# Altium project ESP32-PicoDK-min.PrjPCB
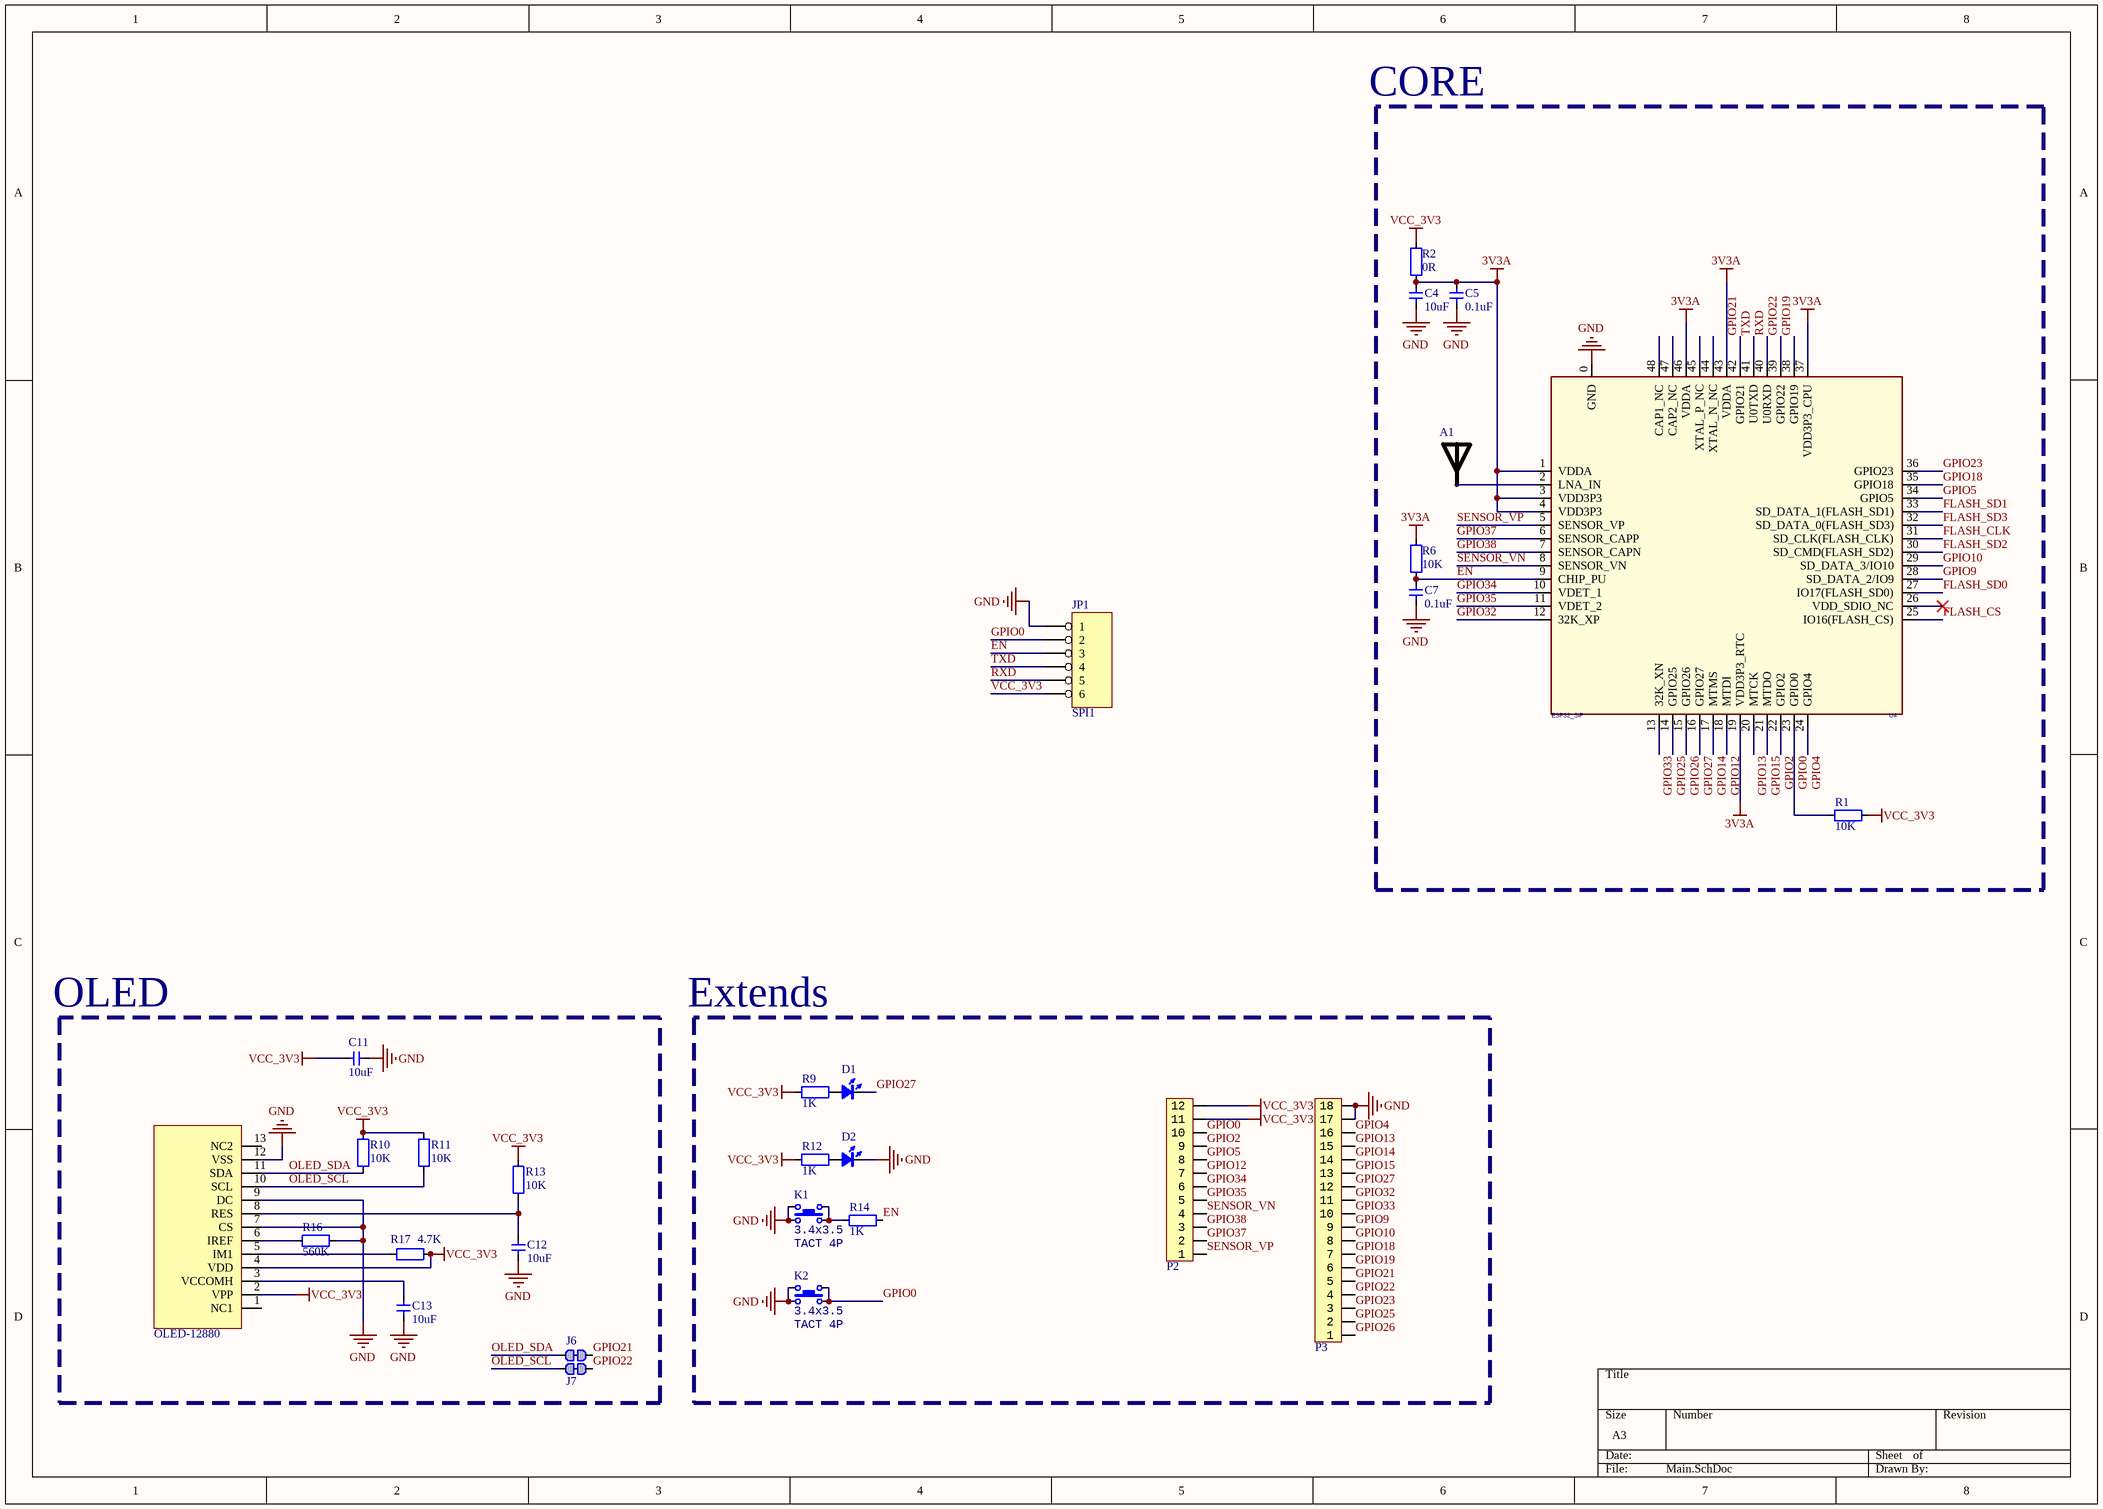
[diagram p0: Main.SchDoc]
1 sheet, 29 parts. Net scope: global (net labels, ports and power ports of the same name join across sheets).
Board file: ESP32-PicoDK-min.PcbDoc

## Sheet Main.SchDoc
size A3

### Parts
1  OLED-12880  [OLED-12880]
A1  RAINSUN  [ANT-Rainsun-AN5120]  (value not drawn)
C4  10uF  [CAP_0402]
C5  0.1uF  [CAP_0402]
C7  0.1uF  [CAP_0402]
C11  10uF  [CAP_0402]
C12  10uF  [CAP_0402]
C13  10uF  [CAP_0402]
D1  color?  [LED_0402_RED]  (value not drawn)
D2  color?  [LED_0402_RED]  (value not drawn)
J6  跳线  [0402-0R]  (value not drawn)
J7  跳线  [0402-0R]  (value not drawn)
JP1  SPI1  [CONN-SMD_6P-P1.25_DEALON_1.25-6PWB]
K1  value 3.4x3.5  [ButtonTACT_3.5*3.55_90]  (hidden comment: TACT 4P)
K2  value 3.4x3.5  [ButtonTACT_3.5*3.55_90]  (hidden comment: TACT 4P)
P2  HDR1x12_2.54  [HDR1X12_2.54_180]  (value not drawn)
P3  HDR1x18_2.54  [HDR1X18_2.54_180]  (value not drawn)
R1  10K  [RES_0402]
R2  0R  [RES_0402]
R6  10K  [RES_0402]
R9  1K  [RES_0402]
R10  10K  [RES_0402]
R11  10K  [RES_0402]
R12  1K  [RES_0402]
R13  10K  [RES_0402]
R14  1K  [RES_0402]
R16  560K  [RES_0402]
R17  4.7K  [RES_0402]
U4  ESP32_SIP  [QFN-48_7X7]

### Nets
3V3A: C4.2 C5.2 R2.2 R6.1 U4.1(VDDA) U4.3(VDD3P3) U4.4(VDD3P3) U4.19(VDD3P3_RTC) U4.37(VDD3P3_CPU) U4.43(VDDA) U4.46(VDDA)
GND: 1.7(CS) 1.9(DC) 1.12(VSS) C4.1 C5.1 C7.2 C11.1 C12.1 C13.1 D2.2(K) JP1.1 K1.1 K1.3 K2.1 K2.3 P3.17 P3.18 R16.2 U4.0(GND)
VCC_3V3: 1.2(VPP) 1.4(VDD) C11.2 JP1.6 P2.11 P2.12 R1.2 R2.1 R9.1 R10.2 R11.2 R12.1 R13.2 R17.2
EN: C7.1 JP1.3 R6.2 R14.2 U4.9(CHIP_PU)
FLASH_CLK: U4.31(SD_CLK(FLASH_CLK))
FLASH_CS: U4.25(IO16(FLASH_CS))
FLASH_SD0: U4.27(IO17(FLASH_SD0))
FLASH_SD1: U4.33(SD_DATA_1(FLASH_SD1))
FLASH_SD2: U4.30(SD_CMD(FLASH_SD2))
FLASH_SD3: U4.32(SD_DATA_0(FLASH_SD3))
GPIO0: JP1.2 K2.2 K2.4 P2.10 R1.1 U4.23(GPIO0)
GPIO2: P2.9 U4.22(GPIO2)
GPIO4: P3.16 U4.24(GPIO4)
GPIO5: P2.8 U4.34(GPIO5)
GPIO9: P3.9 U4.28(SD_DATA_2/IO9)
GPIO10: P3.8 U4.29(SD_DATA_3/IO10)
GPIO12: P2.7 U4.18(MTDI)
GPIO13: P3.15 U4.20(MTCK)
GPIO14: P3.14 U4.17(MTMS)
GPIO15: P3.13 U4.21(MTDO)
GPIO18: P3.7 U4.35(GPIO18)
GPIO19: P3.6 U4.38(GPIO19)
GPIO21: J6.2 P3.5 U4.42(GPIO21)
GPIO22: J7.2 P3.4 U4.39(GPIO22)
GPIO23: P3.3 U4.36(GPIO23)
GPIO25: P3.2 U4.14(GPIO25)
GPIO26: P3.1 U4.15(GPIO26)
GPIO27: D1.2(K) P3.12 U4.16(GPIO27)
GPIO32: P3.11 U4.12(32K_XP)
GPIO33: P3.10 U4.13(32K_XN)
GPIO34: P2.6 U4.10(VDET_1)
GPIO35: P2.5 U4.11(VDET_2)
GPIO37: P2.2 U4.6(SENSOR_CAPP)
GPIO38: P2.3 U4.7(SENSOR_CAPN)
OLED_SCL: 1.10(SCL) J7.1 R11.1
OLED_SDA: 1.11(SDA) J6.1 R10.1
RXD: JP1.5 U4.40(U0RXD)
SENSOR_VN: P2.4 U4.8(SENSOR_VN)
SENSOR_VP: P2.1 U4.5(SENSOR_VP)
TXD: JP1.4 U4.41(U0TXD)
Net1_3: 1.3(VCCOMH) C13.2
Net1_5: 1.5(IM1) R17.1
Net1_6: 1.6(IREF) R16.1
Net1_8: 1.8(RES) C12.2 R13.1
NetA1_1: A1.1 U4.2(LNA_IN)
NetD1_1: D1.1(A) R9.2
NetD2_1: D2.1(A) R12.2
NetK1_2: K1.2 K1.4 R14.1

Not connected (* = marked no-connect by the designer): 1 1(NC1) 13(NC2); U4 26(VDD_SDIO_NC)* 44(XTAL_N_NC) 45(XTAL_P_NC) 47(CAP2_NC) 48(CAP1_NC)

### Notes on the sheet
- CORE
- OLED
- Extends

### Library data of the parts
A1 = ANT-Rainsun-AP5120
C4 C5 C7 C11-C13 = 电容-0402: Capacitor; Value: 0.1u
D1 D2 = LED_0402: LED; Type: 0402; Value: color?
J6 J7 = 跳线: Resistor; Published: 8-Jun-2000; LatestRevisionDate: 17-Jul-2002; LatestRevisionNote: Re-released for DXP Platform.; PackageReference: AXIAL-0.4; Publisher: Altium Limited; PackageDescription: Axial Device, Thru-Hole; 2 Leads; 0.4 in Pin Spacing
JP1 = HEADER 6
K1 K2 = ButtonTACT: Button; type: TACT 4P
P2 = HDR1x12_2.54: Header
P3 = HDR1x18_2.54: Header
R1 R2 R6 R9-R14 R16 R17 = 电阻-0402: Resistor; Value: 22R
U4 = ESP32-PICO